# EAGLE design LPC_4TE_3.42_led (EAGLE 5.06)
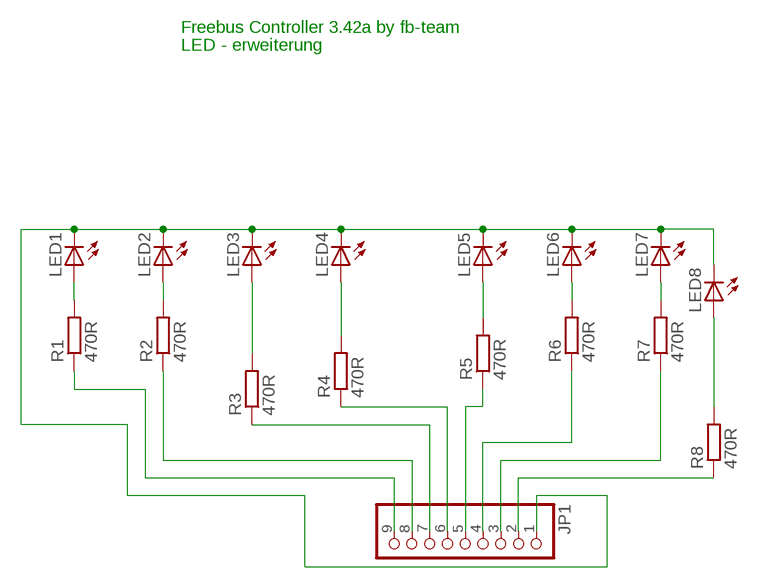
[diagram p0: schematic, sheet 1]

## Parts
JP1  PINHD-1X9  [1X09]
LED1  LED3MM  [LED3MM]
LED2  LED3MM  [LED3MM]
LED3  LED3MM  [LED3MM]
LED4  LED3MM  [LED3MM]
LED5  LED3MM  [LED3MM]
LED6  LED3MM  [LED3MM]
LED7  LED3MM  [LED3MM]
LED8  LED3MM  [LED3MM]
R1  470R  R-EU_0207/10  [0207/10]
R2  470R  R-EU_0207/10  [0207/10]
R3  470R  R-EU_0207/10  [0207/10]
R4  470R  R-EU_0207/10  [0207/10]
R5  470R  R-EU_0207/10  [0207/10]
R6  470R  R-EU_0204/7  [0204/7]
R7  470R  R-EU_0204/7  [0204/7]
R8  470R  R-EU_0204/7  [0204/7]

## Nets
GND: JP1.1 LED1.K(C) LED2.K(C) LED3.K(C) LED4.K(C) LED5.K(C) LED6.K(C) LED7.K(C) LED8.K(C)
N$1: LED2.A R2.2
N$2: JP1.2 R8.1
N$3: JP1.3 R7.1
N$4: LED3.A R3.2
N$5: LED4.A R4.2
N$6: LED1.A R1.2
N$7: LED5.A R5.2
N$8: LED6.A R6.2
N$9: LED7.A R7.2
N$10: LED8.A R8.2
N$12: JP1.5 R5.1
N$21: JP1.4 R6.1
N$32: JP1.8 R2.1
N$33: JP1.7 R3.1
N$35: JP1.6 R4.1
N$45: JP1.9 R1.1

## Notes on the sheet
- Freebus Controller 3.42a by fb-team
- LED - erweiterung

## Library data of the parts
JP1 = pinhead:PINHD-1X9: PIN HEADER
LED1-LED8 = led:LED: LED OSRAM: - CHIPLED LG R971, LG N971, LY N971, LG Q971, LY Q971, LO R971, LY R971 LH N974, LH R974 LS Q976, LO Q976, LY Q976 LO Q996 - Hyper CHIPLED LW Q18S LB Q993, LB Q99A, LB R99A - SideLED LS A670, LO A670, LY A670, LG A670, LP A670 LB A673, LV A673, LT A673, LW A673 LH A674 LY A675 LS A676, LA A676, LO A676, LY A676, LW A676 LS A679, LY A679, LG A679 - Hyper Micro SIDELED® LS Y876, LA Y876, LO Y876, LY Y876 LT Y87S - SmartLED LW L88C, LW L88S LB L89C, LB L89S, LG L890 LS L89K, LO L89K, LY L89K LS L896, LA L896, LO L896, LY L896 - TOPLED LS T670, LO T670, LY T670, LG T670, LP T670 LSG T670, LSP T670, LSY T670, LOP T670, LYG T670 LG T671, LOG T671, LSG T671 LB T673, LV T673, LT T673, LW T673 LH T674 LS T676, LA T676, LO T676, LY T676, LB T676, LH T676, LSB T676, LW T676 LB T67C, LV T67C, LT T67C, LS T67K, LO T67K, LY T67K, LW E67C LS E67B, LA E67B, LO E67B, LY E67B, LB E67C, LV E67C, LT E67C LW T67C LS T679, LY T679, LG T679 LS T770, LO T770, LY T770, LG T770, LP T770 LB T773, LV T773, LT T773, LW T773 LH T774 LS E675, LA E675, LY E675, LS T675 LS T776, LA T776, LO T776, LY T776, LB T776 LHGB T686 LT T68C, LB T68C - Hyper Mini TOPLED® LB M676 - Mini TOPLED Santana® LG M470 LS M47K, LO M47K, LY M47K Source: http://www.osram.convergy.de - LUMILED® LXK2-PW12-R00, LXK2-PW12-S00, LXK2-PW14-U00, LXK2-PW14-V00 LXK2-PM12-R00, LXK2-PM12-S00, LXK2-PM14-U00 LXK2-PE12-Q00, LXK2-PE12-R00, LXK2-PE12-S00, LXK2-PE14-T00, LXK2-PE14-U00 LXK2-PB12-K00, LXK2-PB12-L00, LXK2-PB12-M00, LXK2-PB14-N00, LXK2-PB14-P00, LXK2-PB14-Q00 LXK2-PR12-L00, LXK2-PR12-M00, LXK2-PR14-Q00, LXK2-PR14-R00 LXK2-PD12-Q00, LXK2-PD12-R00, LXK2-PD12-S00 LXK2-PH12-R00, LXK2-PH12-S00 LXK2-PL12-P00, LXK2-PL12-Q00, LXK2-PL12-R00 Source: www.luxeon.com
R1-R8 = rcl:R-EU_: RESISTOR, European symbol

## Board
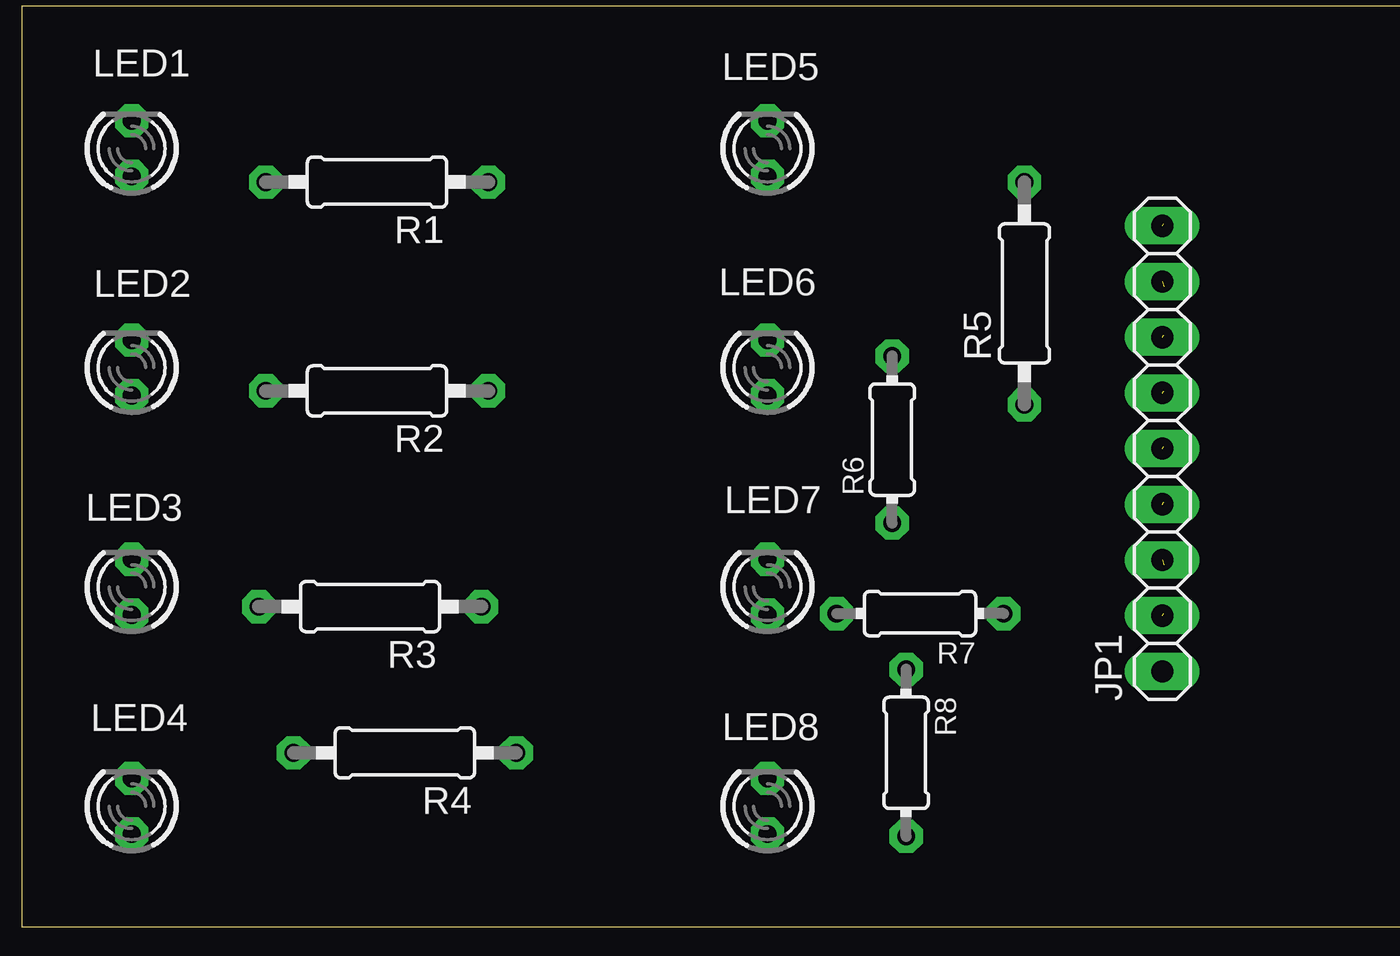
[diagram p1: board, top side]
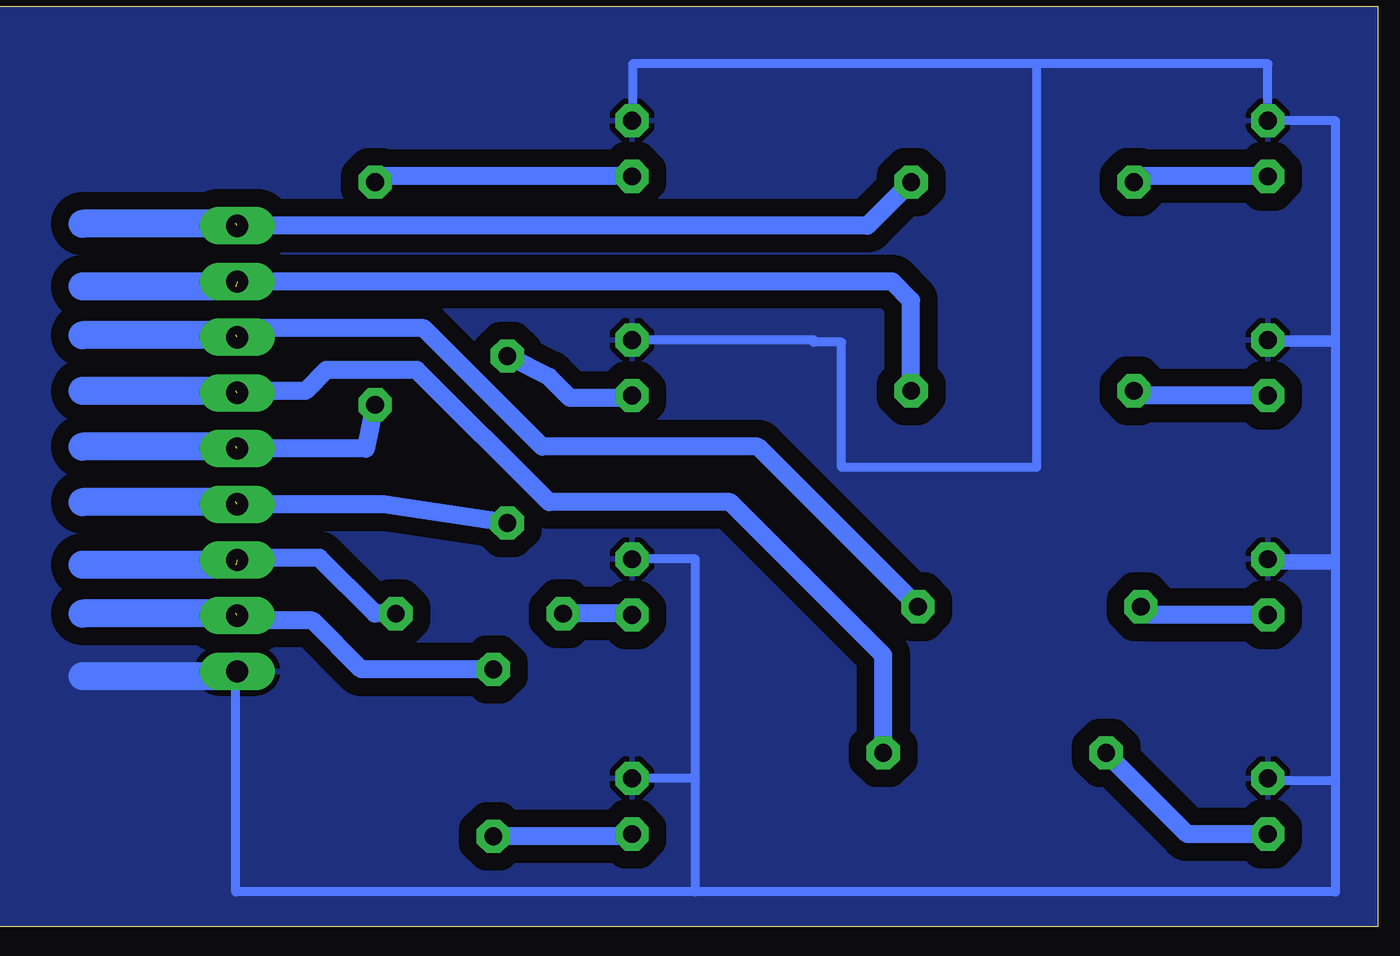
[diagram p2: board, bottom side, seen from below]

No outline drawn. Coordinates in mm, seen from the top.
Copper layers (1*16): Top 0.0356mm / dielectric 1.5011mm / Bottom 0.0356mm
Design rules "0.35mm": minimum track width 0.3505mm, minimum drill 24mil, track to track 0.3505mm, track to pad 0.3505mm, pad to pad 0.3505mm, via to via 0.3505mm, smd to smd 0.3505mm, copper to edge 0mil, drill to drill 8mil, minimum pad ring 0.3505mm, minimum via ring 8mil, stop-mask expansion 4mil, vias tented up to drill 0mil, thermal gap 10mil
Milling: 4 lines

### Footprints (pad centres in the part's own frame; a part is rotated, then mirrored left to right if it is on the bottom)
1X09 = drill 1.016 long: 1 -10.16,0; 2 -7.62,0; 3 -5.08,0; 4 -2.54,0; 5 0,0; 6 2.54,0; 7 5.08,0; 8 7.62,0; 9 10.16,0
LED3MM = drill 0.813 octagon: A -1.27,0; K 1.27,0
0207/10 = drill 0.813 octagon: 1 -5.08,0; 2 5.08,0
0204/7 = drill 0.813 octagon: 1 -3.81,0; 2 3.81,0

### Placement (x,y rotation side)
JP1  52.01,21.82 90 top
LED1  5,35.5 90 top
LED2  5,25.5 90 top
LED3  5,15.5 90 top
LED4  5,5.5 90 top
LED5  34,35.5 90 top
LED6  34,25.5 90 top
LED7  34,15.5 90 top
LED8  34,5.5 90 top
R1  16.19,33.97 180 top
R2  16.19,24.45 180 top
R3  15.88,14.61 180 top
R4  17.46,7.94 180 top
R5  45.72,28.89 90 top
R6  39.69,22.23 90 top
R7  40.96,14.29 180 top
R8  40.32,7.94 270 top

### Tracks (layer width: path | path; a pad name or v marks a point on that pad's centre or on a via)
GND
  Bottom 0.406: LED5.K 33.97,36.77 33.97,39.37 15.56,39.37 | 15.56,39.37 5,39.37 LED1.K 1.91,36.77 1.91,26.67 5,26.67 LED2.K 1.91,26.77 1.91,16.51 5,16.51 LED3.K 1.91,16.77 1.91,6.67 | 1.91,6.67 5,6.67 LED4.K | JP1.1 52.07,11.65 52.07,11.43 52.07,1.59 31.11,1.59 | 31.11,1.59 1.91,1.59 1.91,6.67 | 31.11,6.77 LED8.K | 31.11,1.59 31.11,6.77 | LED7.K 31.11,16.77 31.11,6.77 | LED6.K 25.72,26.77 25.72,26.67 24.45,26.67 24.45,20.95 15.56,20.95 15.56,39.37
  Bottom 1.27: 52.07,11.43 59.05,11.43
  pour Bottom (isolate 0.813): 0,0 67.5,0 67.5,42 0,42
N$1
  Bottom 0.406: 10.89,24.23 R2.2
  Bottom 0.813: LED2.A 10.89,24.23
N$2  (1 unrouted)
  Bottom 0.406: 51.78,13.97 JP1.2
  Bottom 0.813: R8.1 46.35,11.75 48.58,13.97 51.78,13.97
  Bottom 1.27: 52.07,14.29 59.05,14.29
N$3  (1 unrouted)
  Bottom 0.406: 51.91,16.83 JP1.3
  Bottom 0.813: R7.1 45.72,14.29 48.26,16.83 51.91,16.83
  Bottom 1.27: 52.07,16.51 59.05,16.51
N$4
  Bottom 0.406: 10.42,14.23 R3.2
  Bottom 0.813: LED3.A 10.42,14.23
N$5
  Bottom 0.813: LED4.A 8.68,4.23 R4.2
N$6
  Bottom 0.406: 10.86,34.23 R1.2
  Bottom 0.813: LED1.A 10.86,34.23
N$7
  Bottom 0.813: LED5.A 45.46,34.23 R5.2
N$8
  Bottom 0.406: LED6.A 34.1,24.13
  Bottom 0.813: R6.2 37.78,25.08 36.83,24.13 34.1,24.13
N$9
  Bottom 0.406: LED7.A 34.06,14.29
  Bottom 0.813: 34.06,14.29 R7.2
N$10
  Bottom 0.406: LED8.A 34.1,4.13
  Bottom 0.813: 34.1,4.13 R8.2
N$12  (1 unrouted)
  Bottom 0.813: JP1.5 46.13,21.82 R5.1
  Bottom 1.27: 52.07,21.91 59.05,21.91
N$21  (1 unrouted)
  Bottom 0.813: JP1.4 45.31,19.27 R6.1
  Bottom 1.27: 52.07,19.37 59.05,19.37
N$32  (1 unrouted)
  Bottom 0.813: JP1.8 22.13,29.43 21.27,28.57 R2.1
  Bottom 1.27: 52.07,29.21 59.05,29.21
N$33  (1 unrouted)
  Bottom 0.813: R3.1 28.26,21.91 38.1,21.91 43.5,27.3 51.59,27.3 JP1.7
  Bottom 1.27: 52.07,26.99 59.05,26.99
N$35  (1 unrouted)
  Bottom 0.406: 51.91,24.45 JP1.6
  Bottom 0.813: R4.1 22.54,12.38 29.53,19.37 37.78,19.37 43.81,25.4 47.94,25.4 48.9,24.45 51.91,24.45
  Bottom 1.27: 52.07,24.45 59.05,24.45
N$45  (1 unrouted)
  Bottom 0.813: JP1.9 23.27,31.98 R1.1
  Bottom 1.27: 52.07,32.07 59.05,32.07